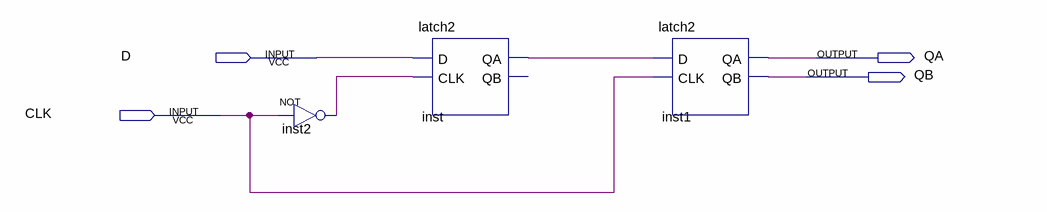
[diagram p0: schematic sheet]
// Quartus schematic flipflop.bdf as structural Verilog: 3 symbols, 4 pins
module flipflop (
  input  D,
  input  CLK,
  output QA,
  output QB
);

  wire inst2_out, inst_qa;

  not inst2 (inst2_out, CLK);
  latch2 inst (.D(D), .CLK(inst2_out), .QA(inst_qa));  // open: QB
  latch2 inst1 (.D(inst_qa), .CLK(CLK), .QA(QA), .QB(QB));
endmodule
